# EAGLE design BigFace (EAGLE 6.4)
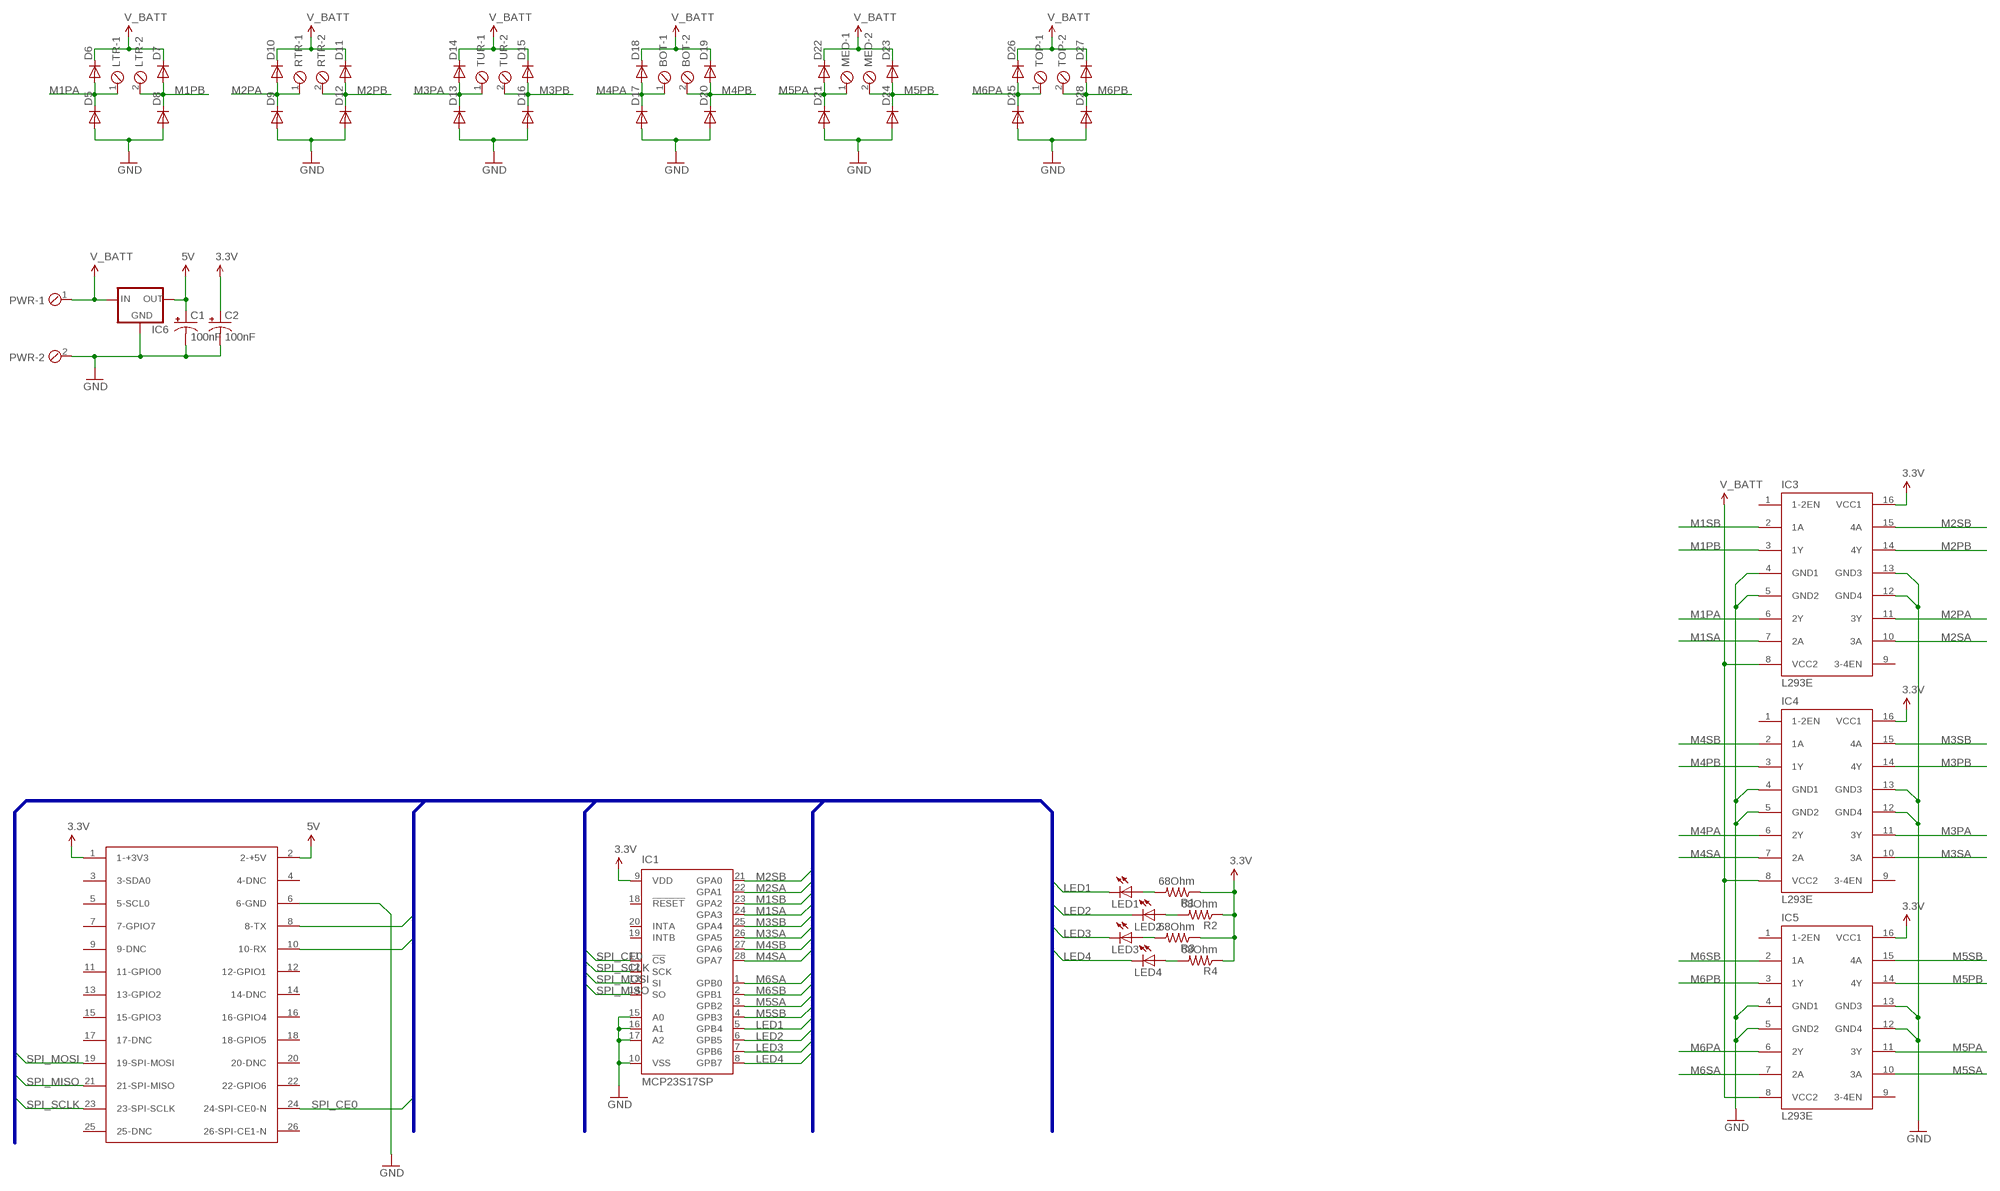
[diagram p0: schematic, sheet 1]

## Parts
BOT  MPT2  [2POL254]
C1  100nF  CAP_POLPTH2  [CPOL-RADIAL-10UF-25V]
C2  100nF  CAP_POLPTH2  [CPOL-RADIAL-10UF-25V]
D5  DIODE1N4148  [DIODE-1N4148]
D6  DIODE1N4148  [DIODE-1N4148]
D7  DIODE1N4148  [DIODE-1N4148]
D8  DIODE1N4148  [DIODE-1N4148]
D9  DIODE1N4148  [DIODE-1N4148]
D10  DIODE1N4148  [DIODE-1N4148]
D11  DIODE1N4148  [DIODE-1N4148]
D12  DIODE1N4148  [DIODE-1N4148]
D13  DIODE1N4148  [DIODE-1N4148]
D14  DIODE1N4148  [DIODE-1N4148]
D15  DIODE1N4148  [DIODE-1N4148]
D16  DIODE1N4148  [DIODE-1N4148]
D17  DIODE1N4148  [DIODE-1N4148]
D18  DIODE1N4148  [DIODE-1N4148]
D19  DIODE1N4148  [DIODE-1N4148]
D20  DIODE1N4148  [DIODE-1N4148]
D21  DIODE1N4148  [DIODE-1N4148]
D22  DIODE1N4148  [DIODE-1N4148]
D23  DIODE1N4148  [DIODE-1N4148]
D24  DIODE1N4148  [DIODE-1N4148]
D25  DIODE1N4148  [DIODE-1N4148]
D26  DIODE1N4148  [DIODE-1N4148]
D27  DIODE1N4148  [DIODE-1N4148]
D28  DIODE1N4148  [DIODE-1N4148]
IC1  MCP23S17SP  [DIL28-3]
IC3  L293E  [DIL16]
IC4  L293E  [DIL16]
IC5  L293E  [DIL16]
IC6  V_REG_78XXSINK  [TO220-IGO]
LED1  LED3MM  [LED3MM]
LED2  LED3MM  [LED3MM]
LED3  LED3MM  [LED3MM]
LED4  LED3MM  [LED3MM]
LTR  MPT2  [2POL254]
MED  MPT2  [2POL254]
PWR  MPT2  [2POL254]
R1  68Ohm  RESISTOREZ  [AXIAL-0.3EZ]
R2  68Ohm  RESISTOREZ  [AXIAL-0.3EZ]
R3  68Ohm  RESISTOREZ  [AXIAL-0.3EZ]
R4  68Ohm  RESISTOREZ  [AXIAL-0.3EZ]
RTR  MPT2  [2POL254]
TOP  MPT2  [2POL254]
TUR  MPT2  [2POL254]
U$1  RASPBERRY-PI  [RASPBERRY-PI]

## Nets
3.3V: C2.1(+) IC1.9(VDD) IC3.16(VCC1) IC4.16(VCC1) IC5.16(VCC1) R1.P$1 R2.P$1 R3.P$1 R4.P$1 U$1.1(1-+3V3)
5V: C1.1(+) IC6.OUT U$1.2(2-+5V)
GND: C1.2(-) C2.2(-) D5.A D8.A D9.A D12.A D13.A D16.A D17.A D20.A D21.A D24.A D25.A D28.A IC1.10(VSS) IC1.15(A0) IC1.16(A1) IC1.17(A2) IC3.4(GND1) IC3.5(GND2) IC3.12(GND4) IC3.13(GND3) IC4.4(GND1) IC4.5(GND2) IC4.12(GND4) IC4.13(GND3) IC5.4(GND1) IC5.5(GND2) IC5.12(GND4) IC5.13(GND3) IC6.GND PWR.2 U$1.6(6-GND)
LED1: IC1.5(GPB4) LED1.K(C)
LED2: IC1.6(GPB5) LED2.K(C)
LED3: IC1.7(GPB6) LED3.K(C)
LED4: IC1.8(GPB7) LED4.K(C)
M1PA: D5.C D6.A IC3.6(2Y) LTR.1
M1PB: D7.A D8.C IC3.3(1Y) LTR.2
M1SA: IC1.24(GPA3) IC3.7(2A)
M1SB: IC1.23(GPA2) IC3.2(1A)
M2PA: D9.C D10.A IC3.11(3Y) RTR.1
M2PB: D11.A D12.C IC3.14(4Y) RTR.2
M2SA: IC1.22(GPA1) IC3.10(3A)
M2SB: IC1.21(GPA0) IC3.15(4A)
M3PA: D13.C D14.A IC4.11(3Y) TUR.1
M3PB: D15.A D16.C IC4.14(4Y) TUR.2
M3SA: IC1.26(GPA5) IC4.10(3A)
M3SB: IC1.25(GPA4) IC4.15(4A)
M4PA: BOT.1 D17.C D18.A IC4.6(2Y)
M4PB: BOT.2 D19.A D20.C IC4.3(1Y)
M4SA: IC1.28(GPA7) IC4.7(2A)
M4SB: IC1.27(GPA6) IC4.2(1A)
M5PA: D21.C D22.A IC5.11(3Y) MED.1
M5PB: D23.A D24.C IC5.14(4Y) MED.2
M5SA: IC1.3(GPB2) IC5.10(3A)
M5SB: IC1.4(GPB3) IC5.15(4A)
M6PA: D25.C D26.A IC5.6(2Y) TOP.1
M6PB: D27.A D28.C IC5.3(1Y) TOP.2
M6SA: IC1.1(GPB0) IC5.7(2A)
M6SB: IC1.2(GPB1) IC5.2(1A)
N$1: U$1.8(8-TX)
N$2: U$1.10(10-RX)
N$3: LED4.A R4.P$2
N$4: LED3.A R3.P$2
N$5: LED2.A R2.P$2
N$6: LED1.A R1.P$2
SPI_CE0: IC1.11(!CS) U$1.24(24-SPI-CE0-N)
SPI_MISO: IC1.14(SO) U$1.21(21-SPI-MISO)
SPI_MOSI: IC1.13(SI) U$1.19(19-SPI-MOSI)
SPI_SCLK: IC1.12(SCK) U$1.23(23-SPI-SCLK)
V_BATT: D6.C D7.C D10.C D11.C D14.C D15.C D18.C D19.C D22.C D23.C D26.C D27.C IC3.8(VCC2) IC4.8(VCC2) IC5.8(VCC2) IC6.IN PWR.1
Unconnected: IC1.18(!RESET) IC1.19(INTB) IC1.20(INTA) IC3.1(1-2EN) IC3.9(3-4EN) IC4.1(1-2EN) IC4.9(3-4EN) IC5.1(1-2EN) IC5.9(3-4EN) U$1.3(3-SDA0) U$1.4(4-DNC) U$1.5(5-SCL0) U$1.7(7-GPIO7) U$1.9(9-DNC) U$1.11(11-GPIO0) U$1.12(12-GPIO1) U$1.13(13-GPIO2) U$1.14(14-DNC) U$1.15(15-GPIO3) U$1.16(16-GPIO4) U$1.17(17-DNC) U$1.18(18-GPIO5) U$1.20(20-DNC) U$1.22(22-GPIO6) U$1.25(25-DNC) U$1.26(26-SPI-CE1-N)

## Buses
B$1

## Library data of the parts
BOT LTR MED PWR RTR TOP TUR = con-phoenix-254:MPT2: PHOENIX CONNECTOR; OC_FARNELL: unknown; OC_NEWARK: unknown
C1 C2 = SparkFun-Capacitors:CAP_POL: Capacitor Polarized These are standard SMD and PTH capacitors. Normally 10uF, 47uF, and 100uF in electrolytic and tantalum varieties. Always verify the external diameter of the through hole cap, it varies with capacity, voltage, and manufacturer. The EIA devices should be standard.
D5-D28 = SparkFun-DiscreteSemi:DIODE: Diode These are standard reverse protection diodes and small signal diodes. SMA package can handle up to about 1A. SOD-323 can handle about 200mA. What the SOD-323 package when ordering, there are some mfgs out there that are 5-pin packages.
IC1 = microchip:MCP23S17: http://ww1.microchip.com/downloads/en/DeviceDoc/21952a.pdf Source: http://ww1.microchip.com/downloads/en/DeviceDoc/21952a.pdf; MF: MICROCHIP; MPN: MCP23S17-E/SP; OC_FARNELL: 1292238; OC_NEWARK: 31K2951
IC3-IC5 = texas:L293E: TI DEVICE; MF: Arrow Electronics; MPN: L293E; OC_FARNELL: 1467711; OC_NEWARK: 89K0732
IC6 = SparkFun-PowerIC:V_REG_78XX: Voltage Regulator Standard 7805 5V regulator. IGO (Input Ground Output). Spark Fun Electronics SKU : COM-00107
LED1-LED4 = SparkFun-LED:LED: LEDs Standard schematic elements and footprints for 5mm, 3mm, 1206, and 0603 sized LEDs. 5mm - Spark Fun Electronics SKU : COM-00529 (and others)
R1-R4 = SparkFun-Resistors:RESISTOR: Resistor Basic schematic elements and footprints for 0603, 1206, and PTH resistors.
U$1 = RaspberryPi:RASPBERRY-PI: Raspberry Pi Board <http://www.raspberrypi.org/> Jacques Lagnel V1.0 (beta) 2012 Board dimension: Forum 3D model <http://www.raspberrypi.org/forum/general-discussion/mechanical-profile-3d-models?value=3d%20model&type=1&include=1&search=1&ret=all> The GPIO Connector (P1): http://elinux.org/RPi_Low-level_peripherals

## Board
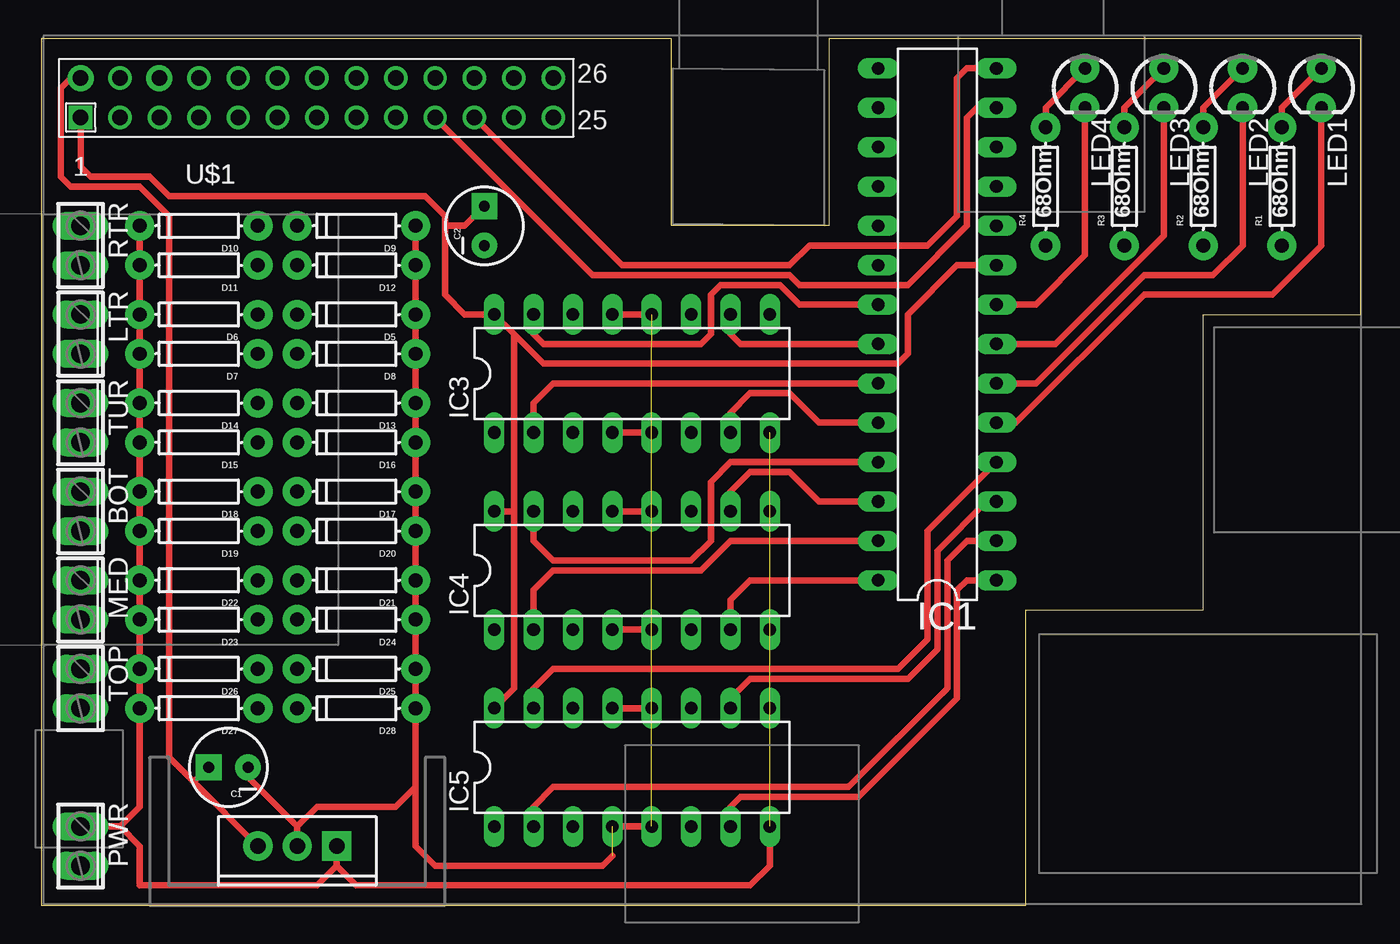
[diagram p1: board, top side]
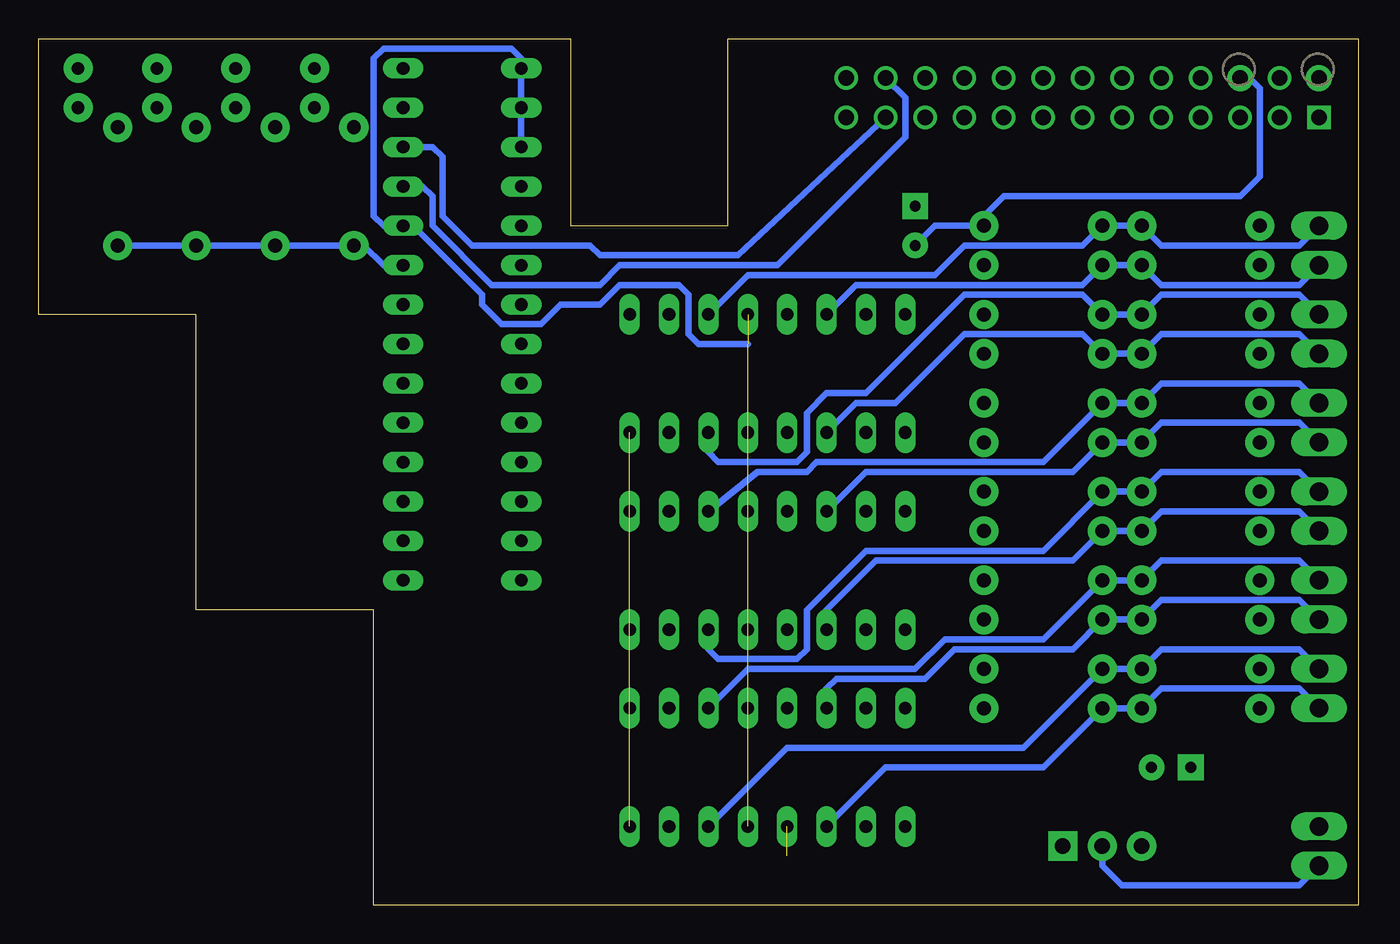
[diagram p2: board, bottom side, seen from below]

Size 85.09 x 55.88 mm. Coordinates in mm from the lower left corner, seen from the top.
Outline: 0,0 63.5,0 63.5,19.05 74.93,19.05 74.93,38.1 85.09,38.1 85.09,55.88 50.8,55.88 50.8,43.81 40.64,43.81 40.64,55.87 0,55.87 0,0
Copper layers (1*16): Top 0.035mm / dielectric 1.5mm / Bottom 0.035mm
Design rules "default": minimum track width 10mil, minimum drill 24mil, track to track 8mil, track to pad 8mil, pad to pad 8mil, via to via 8mil, smd to smd 8mil, copper to edge 40mil, drill to drill 8mil, minimum pad ring 10mil, minimum via ring 8mil, stop-mask expansion 4mil, vias tented up to drill 0mil, thermal gap 10mil

### Footprints (pad centres in the part's own frame; a part is rotated, then mirrored left to right if it is on the bottom)
2POL254 = drill 1.2 long: 1 -1.27,0; 2 1.27,0
CPOL-RADIAL-10UF-25V = drill 0.7 pad 1.651 square: 1 1.27,0 | drill 0.7 pad 1.651: 2 -1.27,0
DIODE-1N4148 = drill 0.9 pad 1.88: A -3.81,0; C 3.81,0
DIL28-3 = drill 0.813 long: 1 -16.51,-3.81; 2 -13.97,-3.81; 3 -11.43,-3.81; 4 -8.89,-3.81; 5 -6.35,-3.81; 6 -3.81,-3.81; 7 -1.27,-3.81; 8 1.27,-3.81; 9 3.81,-3.81; 10 6.35,-3.81; 11 8.89,-3.81; 12 11.43,-3.81; 13 13.97,-3.81; 14 16.51,-3.81; 15 16.51,3.81; 16 13.97,3.81; 17 11.43,3.81; 18 8.89,3.81; 19 6.35,3.81; 20 3.81,3.81; 21 1.27,3.81; 22 -1.27,3.81; 23 -3.81,3.81; 24 -6.35,3.81; 25 -8.89,3.81; 26 -11.43,3.81; 27 -13.97,3.81; 28 -16.51,3.81
DIL16 = drill 0.813 long: 1 -8.89,-3.81; 2 -6.35,-3.81; 3 -3.81,-3.81; 4 -1.27,-3.81; 5 1.27,-3.81; 6 3.81,-3.81; 7 6.35,-3.81; 8 8.89,-3.81; 9 8.89,3.81; 10 6.35,3.81; 11 3.81,3.81; 12 1.27,3.81; 13 -1.27,3.81; 14 -3.81,3.81; 15 -6.35,3.81; 16 -8.89,3.81
TO220-IGO = drill 1 pad 1.88: GND 0,0; OUT 2.54,0 | drill 1 pad 1.88 square: IN -2.54,0
LED3MM = drill 0.813 pad 1.88: A -1.27,0; K 1.27,0
AXIAL-0.3EZ = drill 0.9 pad 1.88: P$1 -3.81,0; P$2 3.81,0
RASPBERRY-PI = drill 1 square: 1 0,0 | drill 1 pad 1.676: 2 0,2.54; 6 5.08,2.54 | drill 1: 3 2.54,0; 4 2.54,2.54; 5 5.08,0; 7 7.62,0; 8 7.62,2.54; 9 10.16,0; 10 10.16,2.54; 11 12.7,0; 12 12.7,2.54; 13 15.24,0; 14 15.24,2.54; 15 17.78,0; 16 17.78,2.54; 17 20.32,0; 18 20.32,2.54; 19 22.86,0; 20 22.86,2.54; 21 25.4,0; 22 25.4,2.54; 23 27.94,0; 24 27.94,2.54; 25 30.48,0; 26 30.48,2.54

### Placement (x,y rotation side)
BOT  2.54,25.4 270 top
C1  12.06,8.89 180 top
C2  28.57,43.81 90 top
D5  20.32,38.1 180 top
D6  10.16,38.1 180 top
D7  10.16,35.56 180 top
D8  20.32,35.56 180 top
D9  20.32,43.81 180 top
D10  10.16,43.81 180 top
D11  10.16,41.27 180 top
D12  20.32,41.27 180 top
D13  20.32,32.38 180 top
D14  10.16,32.38 180 top
D15  10.16,29.84 180 top
D16  20.32,29.84 180 top
D17  20.32,26.67 180 top
D18  10.16,26.67 180 top
D19  10.16,24.13 180 top
D20  20.32,24.13 180 top
D21  20.32,20.95 180 top
D22  10.16,20.95 180 top
D23  10.16,18.41 180 top
D24  20.32,18.41 180 top
D25  20.32,15.24 180 top
D26  10.16,15.24 180 top
D27  10.16,12.7 180 top
D28  20.32,12.7 180 top
IC1  57.78,37.47 90 top
IC3  38.1,34.29 0 top
IC4  38.1,21.59 0 top
IC5  38.1,8.89 0 top
IC6  16.51,3.81 180 top
LED1  82.55,52.7 270 top
LED2  77.47,52.7 270 top
LED3  72.39,52.7 270 top
LED4  67.31,52.7 270 top
LTR  2.54,36.83 270 top
MED  2.54,19.68 270 top
PWR  2.54,3.81 270 top
R1  80.01,46.35 90 top
R2  74.93,46.35 90 top
R3  69.85,46.35 90 top
R4  64.77,46.35 90 top
RTR  2.54,42.55 270 top
TOP  2.54,13.97 270 top
TUR  2.54,31.11 270 top
U$1  2.54,50.8 0 top

### Tracks (layer width: path | path; a pad name or v marks a point on that pad's centre or on a via)
3.3V
  Top 0.406: IC5.16 30.48,13.97 30.48,25.4 | 30.48,25.4 IC4.16 | 30.48,36.83 IC3.16 27.3,38.1 26.04,39.37 26.04,43.81 | 30.48,36.83 30.48,25.4 | U$1.1 2.54,47.62 3.17,46.99 6.99,46.99 8.26,45.72 24.77,45.72 26.04,44.45 26.04,43.81 | 30.48,36.83 32.38,34.92 55.24,34.92 55.88,35.56 55.88,38.1 59.05,41.27 IC1.9 | 26.04,43.81 27.3,43.81 C2.1
  Bottom 0.406: R1.P$1 R2.P$1 R3.P$1 R4.P$1 64.14,42.55 62.87,41.27 IC1.9
5V
  Top 0.406: IC6.OUT 9.84,7.94 | 9.84,7.94 8.26,9.53 8.26,44.45 6.35,46.35 1.91,46.35 1.27,46.99 1.27,52.7 1.91,53.34 U$1.2 | C1.1 9.84,7.94
GND  (7 unrouted)
  Top 0.406: D8.A D5.A D12.A D9.A | D8.A D13.A D16.A D17.A D20.A D21.A D24.A D25.A D28.A | IC6.GND 16.51,5.08 | 16.51,5.08 17.78,6.35 22.86,6.35 24.13,7.62 | 24.13,7.62 D28.A | D8.A D28.A | 24.13,7.62 24.13,3.81 25.4,2.54 36.2,2.54 36.83,3.17 | C1.2 13.34,8.26 16.51,5.08 | IC5.4 IC5.5 | IC4.4 IC4.5 | IC3.4 IC3.5 | IC5.13 IC5.12 | IC3.13 IC3.12 | IC4.13 IC4.12
  Bottom 0.406: PWR.2 3.81,1.27 15.24,1.27 16.51,2.54 IC6.GND | U$1.6 6.99,53.34 6.35,52.7 6.35,46.99 7.62,45.72 22.86,45.72 24.13,44.45 D9.A 27.3,43.81 C2.2 | IC1.17 IC1.16 IC1.15 53.98,54.61 54.61,55.24 62.87,55.24 63.5,54.61 63.5,44.45 62.87,43.81 IC1.10 60.96,43.81 56.52,39.37 56.52,38.73 55.24,37.47 52.7,37.47 51.44,38.73 48.9,38.73 47.62,40.01 43.81,40.01 43.18,39.37 43.18,36.83 42.55,36.2 39.37,36.2
LED1
  Top 0.406: IC1.5 62.87,31.11 71.12,39.37 79.38,39.37 82.55,42.55 LED1.K
LED2
  Top 0.406: IC1.6 64.14,33.66 71.12,40.64 75.56,40.64 77.47,42.55 LED2.K
LED3
  Top 0.406: IC1.7 65.41,36.2 72.39,43.18 LED3.K
LED4
  Top 0.406: IC1.8 64.14,38.73 67.31,41.91 LED4.K
M1PA
  Bottom 0.406: LTR.1 3.81,39.37 12.7,39.37 D6.A D5.C 17.78,39.37 25.4,39.37 31.75,33.02 34.29,33.02 35.56,31.75 35.56,29.21 36.2,28.57 41.27,28.57 41.91,29.21 IC3.6
M1PB
  Bottom 0.406: LTR.2 3.81,36.83 12.7,36.83 D7.A D8.C 17.78,36.83 25.4,36.83 29.84,32.38 32.38,32.38 IC3.3
M1SA
  Top 0.406: IC1.24 50.16,31.11 48.26,33.02 45.72,33.02 44.45,31.75 IC3.7
M1SB
  Top 0.406: IC1.23 33.02,33.66 31.75,32.38 IC3.2
M2PA
  Bottom 0.406: RTR.1 3.81,42.55 12.7,42.55 D10.A D9.C 17.78,42.55 25.4,42.55 27.3,40.64 39.37,40.64 IC3.11
M2PB
  Bottom 0.406: RTR.2 3.81,40.01 12.7,40.01 D11.A D12.C 17.78,40.01 32.38,40.01 IC3.14
M2SA
  Top 0.406: IC1.22 45.09,36.2 44.45,36.83 IC3.10
M2SB
  Top 0.406: IC1.21 48.9,38.73 47.62,40.01 43.81,40.01 43.18,39.37 43.18,36.83 42.55,36.2 32.38,36.2 31.75,36.83 IC3.15
M3PA
  Bottom 0.406: TUR.1 3.81,33.66 12.7,33.66 D14.A D13.C 20.32,28.57 34.92,28.57 35.56,27.94 38.73,27.94 IC4.11
M3PB
  Bottom 0.406: TUR.2 3.81,31.11 12.7,31.11 D15.A D16.C 18.41,27.94 31.75,27.94 IC4.14
M3SA
  Top 0.406: IC1.26 50.16,26.04 48.26,27.94 45.72,27.94 44.45,26.67 IC4.10
M3SB
  Top 0.406: IC1.25 44.45,28.57 43.18,27.3 43.18,23.5 41.91,22.23 33.02,22.23 31.75,23.5 IC4.15
M4PA
  Bottom 0.406: BOT.1 3.81,27.94 12.7,27.94 D18.A D17.C 20.32,22.86 31.75,22.86 35.56,19.05 35.56,16.51 36.2,15.88 41.27,15.88 41.91,16.51 IC4.6
M4PB
  Bottom 0.406: BOT.2 3.81,25.4 12.7,25.4 D19.A D20.C 18.41,22.23 31.11,22.23 34.29,19.05 IC4.3
M4SA
  Top 0.406: IC1.28 45.72,20.95 44.45,19.68 IC4.7
M4SB
  Top 0.406: IC1.27 44.45,23.5 42.55,21.59 33.02,21.59 31.75,20.32 IC4.2
M5PA
  Bottom 0.406: MED.1 3.81,22.23 12.7,22.23 D22.A D21.C 20.32,17.14 26.67,17.14 28.57,15.24 39.37,15.24 IC5.11
M5PB
  Bottom 0.406: MED.2 3.81,19.68 12.7,19.68 D23.A D24.C 18.41,16.51 26.04,16.51 27.94,14.61 33.66,14.61 34.29,13.97 IC5.14
M5SA
  Top 0.406: IC1.3 60.96,26.04 57.78,22.86 57.78,16.51 55.88,14.61 45.72,14.61 44.45,13.34 IC5.10
M5SB
  Top 0.406: IC1.4 57.15,24.13 57.15,17.14 55.24,15.24 33.02,15.24 31.75,13.97 IC5.15
M6PA
  Bottom 0.406: TOP.1 3.81,16.51 12.7,16.51 D26.A D25.C 21.59,10.16 36.83,10.16 IC5.6
M6PB
  Bottom 0.406: TOP.2 3.81,13.97 12.7,13.97 D27.A D28.C 20.32,8.89 30.48,8.89 IC5.3
M6SA
  Top 0.406: IC1.1 59.69,20.95 59.05,20.32 59.05,13.34 52.7,6.99 45.09,6.99 44.45,6.35 IC5.7
M6SB
  Top 0.406: IC1.2 59.69,23.5 58.42,22.23 58.42,13.97 52.07,7.62 33.02,7.62 31.75,6.35 IC5.2
N$3
  Top 0.406: R4.P$2 64.77,51.44 LED4.A
N$4
  Top 0.406: R3.P$2 69.85,51.44 LED3.A
N$5
  Top 0.406: R2.P$2 74.93,51.44 LED2.A
N$6
  Top 0.406: R1.P$2 80.01,51.44 LED1.A
SPI_CE0
  Bottom 0.406: U$1.24 29.21,52.07 29.21,49.53 37.47,41.27 47.62,41.27 48.9,40.01 55.88,40.01 59.69,43.81 59.69,45.72 60.33,46.35 IC1.11
SPI_MISO
  Top 0.406: U$1.21 37.47,41.27 48.26,41.27 49.53,42.55 57.15,42.55 59.05,44.45 59.05,53.34 59.69,53.98 IC1.14
SPI_MOSI
  Top 0.406: U$1.19 35.56,40.64 48.26,40.64 48.9,40.01 55.88,40.01 59.69,43.81 59.69,50.8 60.33,51.44 IC1.13
SPI_SCLK
  Bottom 0.406: U$1.23 40.01,41.91 48.9,41.91 49.53,42.55 57.15,42.55 59.05,44.45 59.05,48.26 59.69,48.9 IC1.12
V_BATT  (2 unrouted)
  Top 0.406: D10.C D11.C D6.C D7.C D14.C D15.C D18.C D19.C D22.C D23.C D26.C D27.C 6.35,6.35 5.08,5.08 | 5.08,5.08 PWR.1 | IC6.IN 19.05,2.54 | 19.05,2.54 17.78,1.27 6.35,1.27 6.35,3.81 5.08,5.08 | 19.05,2.54 20.32,1.27 45.72,1.27 46.99,2.54 IC5.8

### Text on the board
_tNames: LED4 | LED3 | LED2 | LED1 | U$1 | RTR | R4 | R3 | R2 | R1 | D10 | D9 | C2 | LTR | D11 | D12 | D6 | D5 | TUR | D7 | D8 | D14 | D13 | IC3 | D15 | D16 | BOT | D18 | D17 | D19 | D20 | MED | D22 | D21 | IC1 | IC4 | TOP | D23 | D24 | D26 | D25 | D27 | D28 | PWR | C1 | IC5